# EAGLE design adf5355_eval (EAGLE 6.5.0)
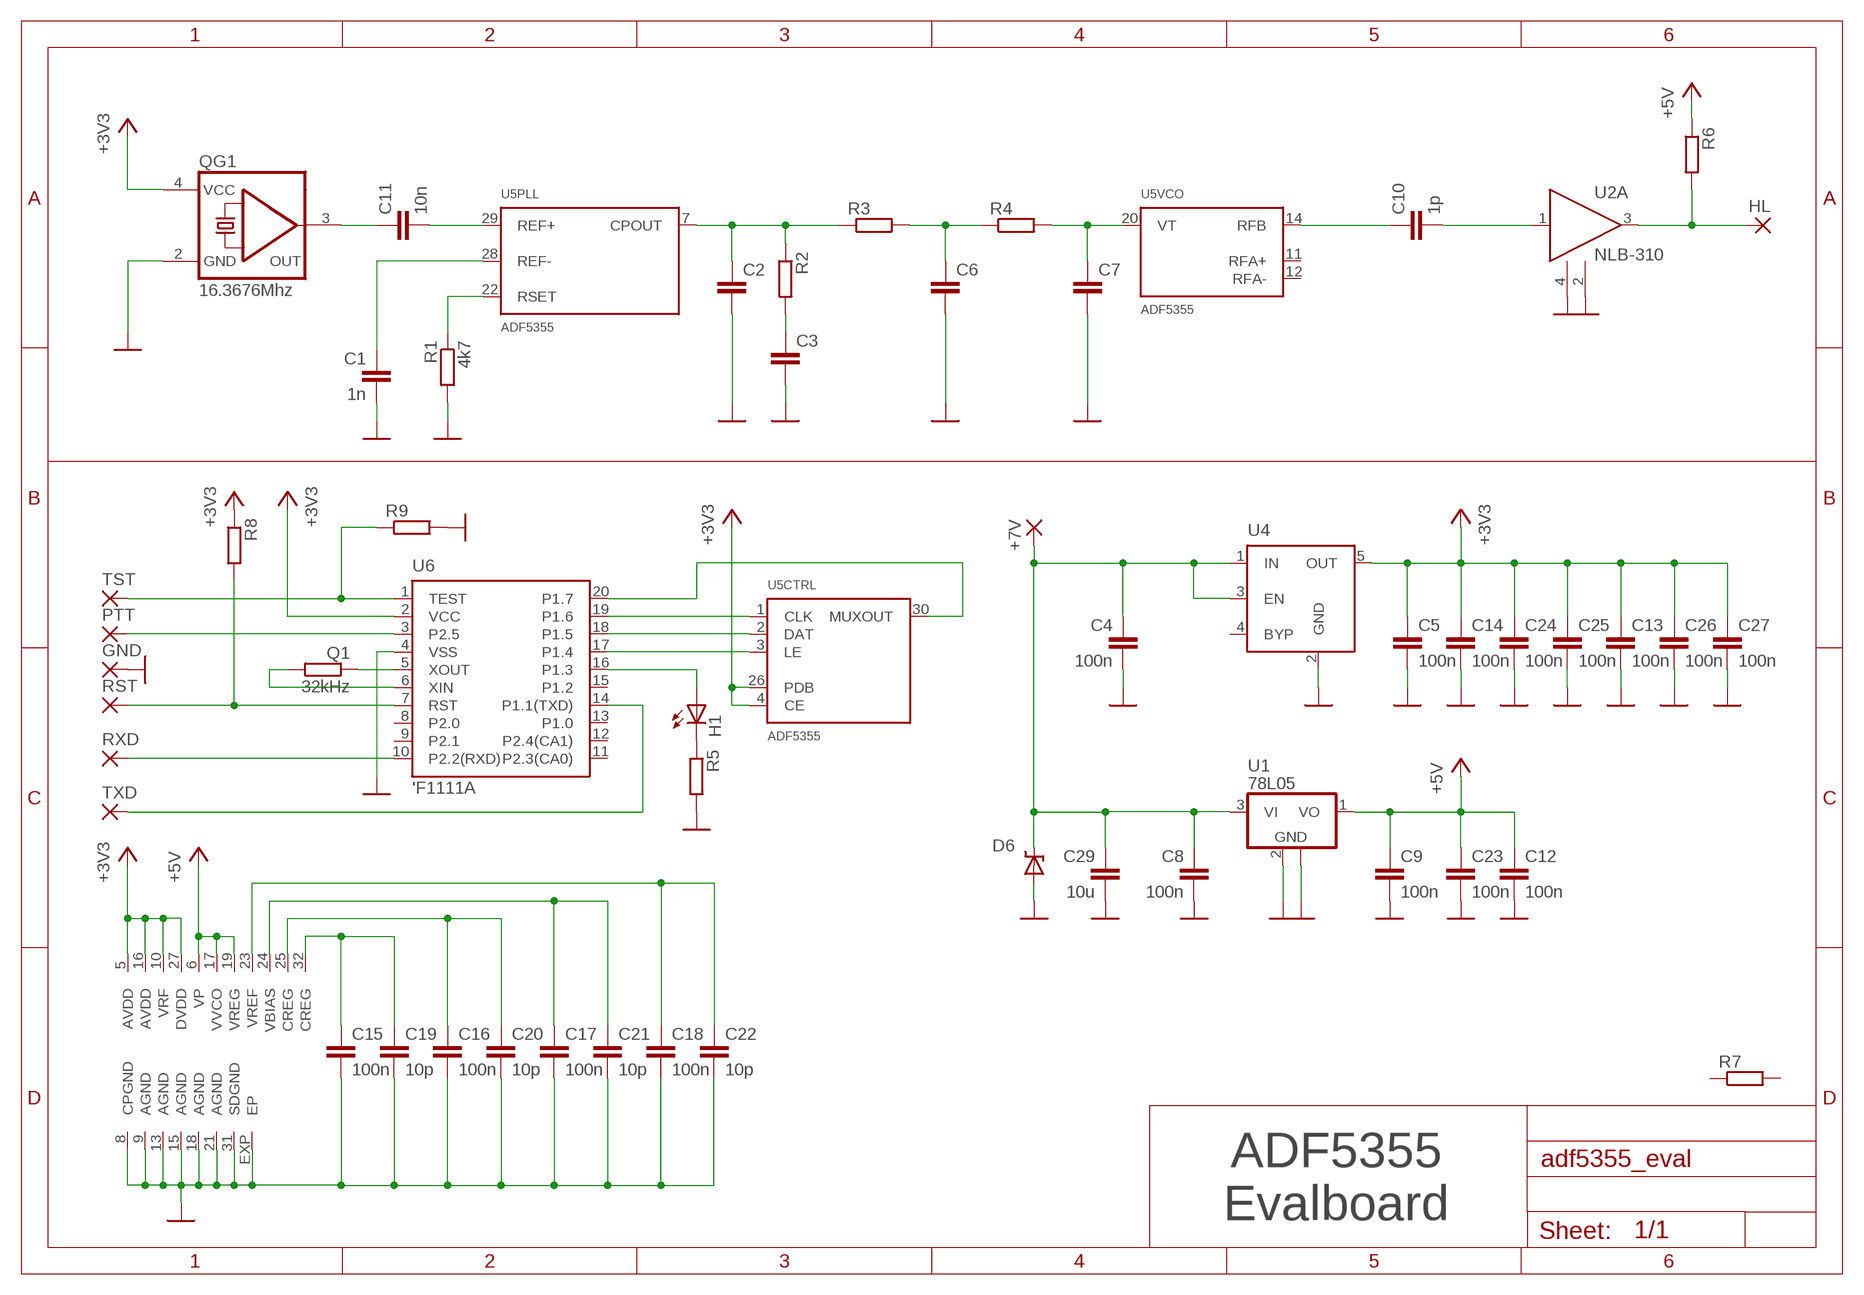
[diagram p0: schematic, sheet 1]

## Parts
+7V  SMD2  [SMD1,27-2,54]
C1  1n  C-EUC0402  [C0402]
C2  C-EUC0402  [C0402]
C3  C-EUC0402  [C0402]
C4  100n  C-EUC0805  [C0805]
C5  100n  C-EUC0402  [C0402]
C6  C-EUC0402  [C0402]
C7  C-EUC0402  [C0402]
C8  100n  C-EUC0805  [C0805]
C9  100n  C-EUC0805  [C0805]
C10  1p  C-EUC0603  [C0603]
C11  10n  C-EUC0402  [C0402]
C12  100n  C-EUC0402  [C0402]
C13  100n  C-EUC0402  [C0402]
C14  100n  C-EUC0805  [C0805]
C15  100n  C-EUC0402  [C0402]
C16  100n  C-EUC0402  [C0402]
C17  100n  C-EUC0402  [C0402]
C18  100n  C-EUC0402  [C0402]
C19  10p  C-EUC0402  [C0402]
C20  10p  C-EUC0402  [C0402]
C21  10p  C-EUC0402  [C0402]
C22  10p  C-EUC0402  [C0402]
C23  100n  C-EUC0603  [C0603]
C24  100n  C-EUC0805  [C0805]
C25  100n  C-EUC0402  [C0402]
C26  100n  C-EUC0402  [C0402]
C27  100n  C-EUC0402  [C0402]
C29  10u  C-EUC0805  [C0805]
D6  SUPPRESSOR-SMBJ  [SMBJ]
GND  SMD2  [SMD1,27-2,54]
H1  PL006-WCR12  [SOT23]
HL  1,6/0,9  [1,6/0,9]
PTT  SMD2  [SMD1,27-2,54]
Q1  32kHz  R-EU_R1206  [R1206]
QG1  16.3676Mhz  XO  [CTS406]
R1  4k7  R-EU_R0402  [R0402]
R2  R-EU_R0402  [R0402]
R3  R-EU_R0402  [R0402]
R4  R-EU_R0402  [R0402]
R5  R-EU_R0603  [R0603]
R6  R-EU_R0603  [R0603]
R7  R-EU_R0402  [R0402]
R8  R-EU_R0402  [R0402]
R9  R-EU_R0402  [R0402]
RST  SMD2  [SMD1,27-2,54]
RXD  SMD2  [SMD1,27-2,54]
TST  SMD2  [SMD1,27-2,54]
TXD  SMD2  [SMD1,27-2,54]
U1  78L05  78L05F  [SOT89]
U2  NLB-310  ERA  [WW107]
U4  MIC5219XX  [SOT23-5]
U5  ADF5355  [LFCSP32]
U6  'F1111A  F11X1A---PW20  [PW20]

## Nets
+3V3: C5.1 C13.1 C14.1 C24.1 C25.1 C26.1 C27.1 QG1.4(VCC) R8.1 U4.5(OUT) U5.4(CTRL:CE) U5.5(PWR:AVDD) U5.10(PWR:VRF) U5.16(PWR:AVDD) U5.26(CTRL:PDB) U5.27(PWR:DVDD) U6.2(VCC)
+5V: C9.1 C12.1 C23.1 R6.1 U1.1(VO) U5.6(PWR:VP) U5.17(PWR:VVCO) U5.19(PWR:VREG)
GND: C1.2 C2.2 C3.2 C4.2 C5.2 C6.2 C7.2 C8.2 C9.2 C12.2 C13.2 C14.2 C15.2 C16.2 C17.2 C18.2 C19.2 C20.2 C21.2 C22.2 C23.2 C24.2 C25.2 C26.2 C27.2 C29.2 D6.A GND.1(P) QG1.2(GND) R1.2 R5.2 R9.2 U1.2(GND) U1.2@1(GND) U2.2(P:GND) U2.4(P:GND) U4.2(GND) U5.8(PWR:CPGND) U5.9(PWR:AGND) U5.13(PWR:AGND) U5.15(PWR:AGND) U5.18(PWR:AGND) U5.21(PWR:AGND) U5.31(PWR:SDGND) U5.EXP(PWR:EP) U6.4(VSS)
N$1: C6.1 R3.2 R4.1
N$2: C2.1 R2.1 R3.1 U5.7(PLL:CPOUT)
N$3: R1.1 U5.22(PLL:RSET)
N$4: C1.1 U5.28(PLL:REF-)
N$5: C7.1 R4.2 U5.20(VCO:VT)
N$6: +7V.1(P) C4.1 C8.1 C29.1 D6.C U1.3(VI) U4.1(IN) U4.3(EN)
N$7: C11.2 U5.29(PLL:REF+)
N$8: C11.1 QG1.3(OUT)
N$9: C10.1 U5.14(VCO:RFB)
N$10: C10.2 U2.1(A:IN)
N$11: R9.1 TST.1(P) U6.1(TEST)
N$12: C3.1 R2.2
N$13: HL.1(P) R6.2 U2.3(A:OUT)
N$14: R8.2 RST.1(P) U6.7(RST)
N$15: PTT.1(P) U6.3(P2.5)
N$17: H1.1(A) U6.16(P1.3)
N$18: H1.3(C) R5.1
N$20: C18.1 C22.1 U5.23(PWR:VREF)
N$22: C17.1 C21.1 U5.24(PWR:VBIAS)
N$23: Q1.2 U6.6(XIN)
N$24: C16.1 C20.1 U5.25(PWR:CREG)
N$25: Q1.1 U6.5(XOUT)
N$26: C15.1 C19.1 U5.32(PWR:CREG)
N$27: RXD.1(P) U6.10(P2.2(RXD))
N$33: TXD.1(P) U6.14(P1.1(TXD))
N$34: U5.1(CTRL:CLK) U6.19(P1.6)
N$35: U5.2(CTRL:DAT) U6.18(P1.5)
N$36: U5.3(CTRL:LE) U6.17(P1.4)
N$37: U5.30(CTRL:MUXOUT) U6.20(P1.7)
Unconnected: R7.1 R7.2 U4.4(BYP) U5.11(VCO:RFA+) U5.12(VCO:RFA-) U6.8(P2.0) U6.9(P2.1) U6.11(P2.3(CA0)) U6.12(P2.4(CA1)) U6.13(P1.0) U6.15(P1.2)

## Notes on the sheet
- ADF5355
  Evalboard

## Library data of the parts
+7V GND PTT RST RXD TST TXD = wirepad:SMD2: SMD PAD
C1-C27 C29 = rcl:C-EU: CAPACITOR, European symbol
D6 = diode:SUPPRESSOR-: Suppressor diode
H1 = led:PL006*: PLH006 Series SMD LED SOT23 PLH006-WCR21 Super Red PLH006-WCR12 High Eff Red PLH006-WCG13 Green PLH006-WCY01 Yellow www.p-tec.net Source: http://www.wittig-electronic.de/PTEC/PL006Series.pdf
HL = wirepad:1,6/0,9: THROUGH-HOLE PAD
Q1 R1-R9 = rcl:R-EU_: RESISTOR, European symbol
QG1 = RS92TCXO:XO: CRYSTAL
U1 = linear:78L*: POSITOIV-VOLTAGE REGULATORS Output up to 100 mA Source: http://focus.ti.com/lit/ds/symlink/ua78l05.pdf
U2 = ERA:ERA
U4 = v-reg-micrel:MIC5219XX: VOLTAGE REGULATOR; OC_FARNELL: unknown; OC_NEWARK: unknown
U5 = ADF5355:ADF5355
U6 = TI_MSP430_v16:F11X1A---PW20: *** MSP430F11x1A *** PW20

## Board
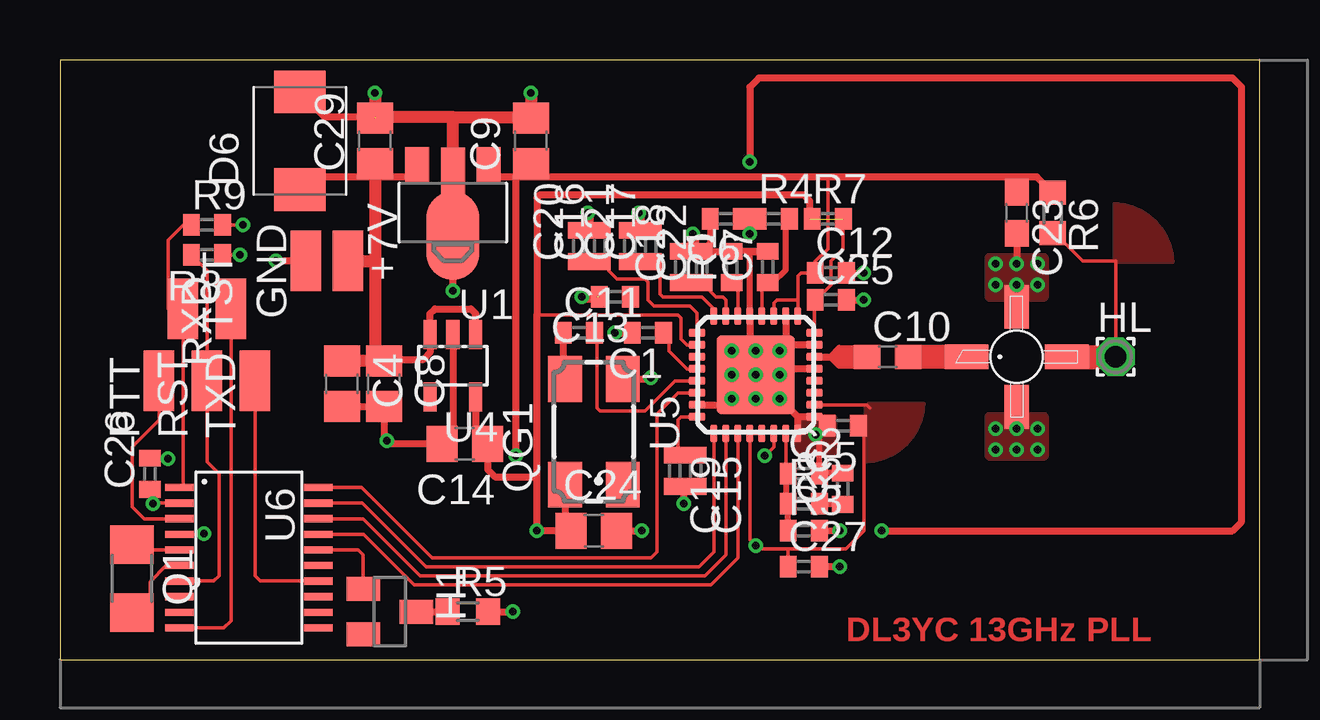
[diagram p1: board, top side]
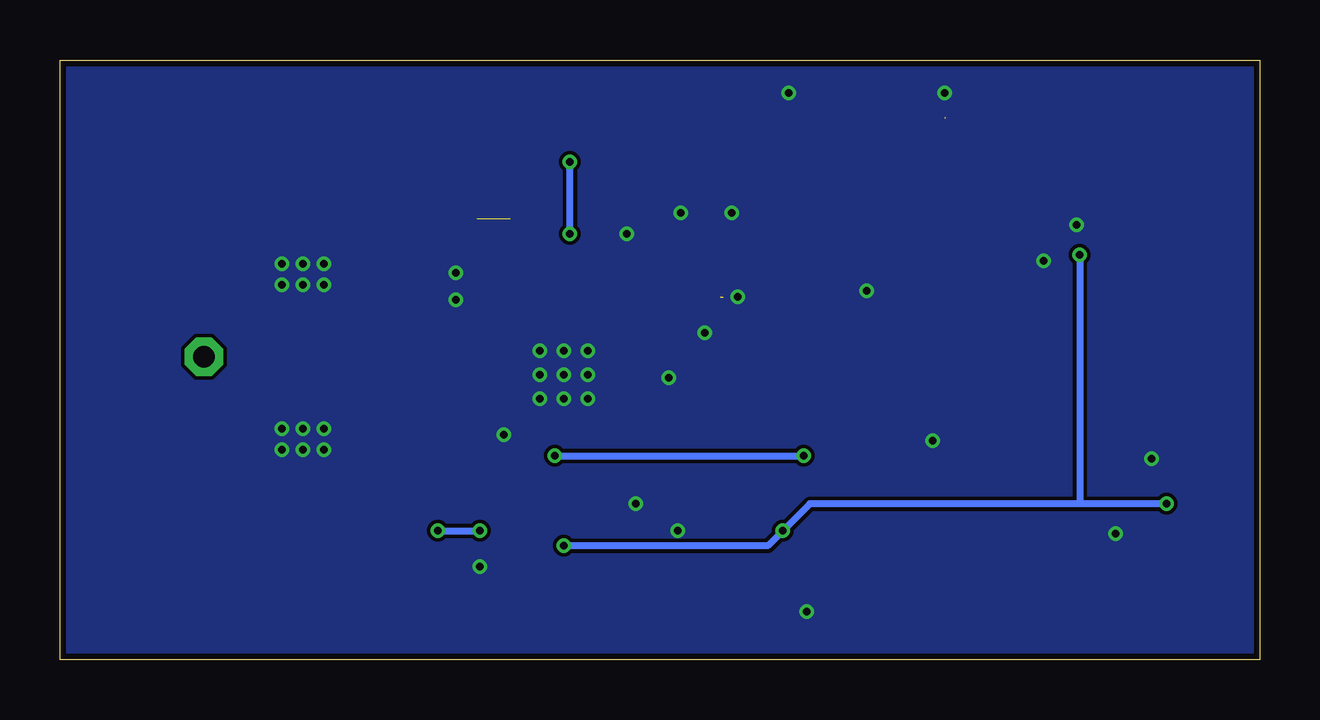
[diagram p2: board, bottom side, seen from below]

Size 50 x 25 mm. Coordinates in mm from the lower left corner, seen from the top.
Outline: 0,0 50,0 50,25 0,25 0,0
Copper layers (1*16): Top 0.035mm / dielectric 1.5mm / Bottom 0.035mm
Design rules "SeeedStudio_2layer_DRU_no_angle_20140221 *": minimum track width 6mil, minimum drill 12mil, track to track 6mil, track to pad 6mil, pad to pad 6mil, via to via 6mil, smd to smd 0mil, copper to edge 10mil, drill to drill 10mil, minimum pad ring 10mil, minimum via ring 6mil, stop-mask expansion 2mil, vias tented up to drill 100mil, thermal gap 10mil

### Footprints (pad centres in the part's own frame; a part is rotated, then mirrored left to right if it is on the bottom)
SMD1,27-2,54 = smd 1.27 x 2.54: 1 0,0
C0402 = smd 0.7 x 0.9: 1 -0.65,0; 2 0.65,0
C0805 = smd 1.3 x 1.5: 1 -0.95,0; 2 0.95,0
C0603 = smd 1.1 x 1: 1 -0.85,0; 2 0.85,0
SMBJ = smd 1.78 x 2.16: A 2.04,0; C -2.03,0
SOT23 = smd 1 x 1.4: 1 -0.95,-1.1; 2 0.95,-1.1; 3 0,1.1
1,6/0,9 = drill 0.914 pad 1.6 octagon: 1 0,0
R1206 = smd 1.6 x 1.803: 1 -1.422,0; 2 1.422,0
CTS406 = smd 1.9 x 1.4: 1 -2.2,-1.2; 2 2.2,-1.2; 3 2.2,1.2; 4 -2.2,1.2
R0402 = smd 0.7 x 0.9: 1 -0.65,0; 2 0.65,0
R0603 = smd 1 x 1.1: 1 -0.85,0; 2 0.85,0
SOT89 = smd 1 x 1.5: 1 -1.499,-1.981; 3 1.499,-1.981 | smd 1 x 2: 2 0,-1.727 | smd 2.2 x 3.7: 2@1 0,0.94
WW107 = smd 1.02 x 1.83: 1 0,-2.085; 3 0,2.085 | smd 1.83 x 1.02: 2 2.085,0; 4 -2.085,0
SOT23-5 = smd 0.55 x 1.2: 1 -0.95,-1.3; 2 0,-1.3; 3 0.95,-1.3; 4 0.95,1.3; 5 -0.95,1.3
LFCSP32 = smd 0.7 x 0.3: 1 -2.45,1.75; 2 -2.45,1.25; 3 -2.45,0.75; 4 -2.45,0.25; 5 -2.45,-0.25; 6 -2.45,-0.75; 7 -2.45,-1.25; 8 -2.45,-1.75; 17 2.45,-1.75; 18 2.45,-1.25; 19 2.45,-0.75; 20 2.45,-0.25; 21 2.45,0.25; 22 2.45,0.75; 23 2.45,1.25; 24 2.45,1.75 | smd 0.3 x 0.7: 9 -1.75,-2.45; 10 -1.25,-2.45; 11 -0.75,-2.45; 12 -0.25,-2.45; 13 0.25,-2.45; 14 0.75,-2.45; 15 1.25,-2.45; 16 1.75,-2.45; 25 1.75,2.45; 26 1.25,2.45; 27 0.75,2.45; 28 0.25,2.45; 29 -0.25,2.45; 30 -0.75,2.45; 31 -1.25,2.45; 32 -1.75,2.45 | smd 3.25 x 3.25: EXP 0,0
PW20 = smd 0.3 x 1.2: 1 -2.925,-2.9; 2 -2.275,-2.9; 3 -1.625,-2.9; 4 -0.975,-2.9; 5 -0.325,-2.9; 6 0.325,-2.9; 7 0.975,-2.9; 8 1.625,-2.9; 9 2.275,-2.9; 10 2.925,-2.9; 11 2.925,2.9; 12 2.275,2.9; 13 1.625,2.9; 14 0.975,2.9; 15 0.325,2.9; 16 -0.325,2.9; 17 -0.975,2.9; 18 -1.625,2.9; 19 -2.275,2.9; 20 -2.925,2.9

### Placement (x,y rotation side)
+7V  12,16.62 180 top
C1  24.5,13.62 180 top
C2  31,7.75 0 top
C3  32.62,7.12 90 top
C4  11.75,11.5 270 top
C5  32.62,9.75 180 top
C6  27.75,18.38 180 top
C7  29.5,16.38 90 top
C8  13.5,11.5 270 top
C9  19.62,21.62 90 top
C10  34.5,12.62 0 top
C11  21.62,13.62 0 top
C12  32.12,16.12 0 top
C13  23.12,15.12 180 top
C14  16.88,9 180 top
C15  26.5,7.88 270 top
C16  22.5,17.25 90 top
C17  24.62,17.25 90 top
C18  25.88,16.38 90 top
C19  25.62,7.88 270 top
C20  21.62,17.25 90 top
C21  23.75,17.25 90 top
C22  26.75,16.38 90 top
C23  39.88,18.62 270 top
C24  22.25,5.38 0 top
C25  32.12,15 0 top
C26  3.75,7.75 90 top
C27  31,3.88 0 top
C29  13.12,21.62 90 top
D6  10,21.62 90 top
GND  10.25,16.62 0 top
H1  13.75,2 270 top
HL  44,12.62 0 top
PTT  4.12,11.62 0 top
Q1  3,3.38 270 top
QG1  22.25,9.5 90 top
R1  28,16.38 90 top
R2  31,6.5 0 top
R3  31,5.38 0 top
R4  29.75,18.38 0 top
R5  17,2 0 top
R6  41.38,18.62 270 top
R7  32,18.38 0 top
R8  6.12,16.88 180 top
R9  6.12,18.12 0 top
RST  6.12,11.62 0 top
RXD  7.12,14.62 0 top
TST  5.12,14.62 180 top
TXD  8.12,11.62 0 top
U1  16.38,18.62 180 top
U2  39.88,12.62 270 top
U4  16.38,12.25 180 top
U5  29,11.88 90 top
U6  7.88,4.25 270 top

### Tracks (layer width: path | path; a pad name or v marks a point on that pad's centre or on a via)
+3V3  (via drill 0.3)  (1 unrouted)
  Top 0.152: U5.10 32.38,10.62
  Top 0.155: U5.27 U5.26 26.12,13.12 25.88,13.38 25.88,14.25 25.75,14.38 23.75,14.38 | 23.75,14.38 19.88,14.38 | U5.5 U5.4 28.75,5 v29,4.75 29.12,4.62 30.38,4.62 | 30.38,4.62 32.75,4.62 33.5,5.38 33.5,9.53 C5.1 | U5.16 31.45,14.6 C25.1 31.48,14.97 32.12,15.62 32.12,16.62 32.62,17.12 32.62,18.38 | U6.2 3.9,6.53 v3.88,6.5 C26.1 | 32.38,10.62 33.62,10.62 33.75,10.5 | C13.1 23.77,14.4 23.75,14.38 | C27.1 30.35,4.6 30.38,4.62 | R8.1 v7.5,16.88
  Top 0.3: 19.88,7.5 v19.88,5.38 C24.1 21.05,5.62 QG1.4 | 19.88,7.5 19.88,14.38 19.88,19.25 20,19.38 31,19.38 31.25,19.12 31.25,18.38 | U4.5 17.32,9.5 C14.1 17.82,7.92 18.12,7.62 19.75,7.62 19.88,7.5
  Bottom 0.3: v29,4.75 20.5,4.75 v19.88,5.38 18.75,6.5 7.5,6.5 | v3.88,6.5 7.5,6.5 | v7.5,16.88 7.5,6.5
  pour Top (no thermals): 33.69,10.68 33.57,10.56 33.58,8.24 33.95,8.28 34.32,8.38 34.67,8.53 34.99,8.73 35.27,8.98 35.52,9.26 35.72,9.58 35.87,9.93 35.97,10.3 36.01,10.67
+5V  (via drill 0.3)
  Top 0.155: U5.6 29.75,8.88 v29.38,8.5 | U5.19 29.75,14.88 29.88,15 30.75,15 | U5.17 30.75,15 | 32,20.12 32,17.12 31.48,16.6 C12.1 30.88,16.12 30.75,16 30.75,15
  Top 0.3: 39.88,20.12 40.73,20.12 R6.1 | 39.88,20.12 32,20.12 19.62,20.12 | 19.62,20.12 19,20.12 | C23.1 39.88,20.12 | v19,8.5 19,20.12 | 19,20.12 18.36,20.12 U1.1 | C9.1 19.62,20.12
  Bottom 0.3: v29.38,8.5 v19,8.5
GND  (via drill 0.3)  (2 unrouted)
  Top 0.155: U6.4 5.9,5.22 v6,5.25 | v4.5,8.38 C26.2 | R9.2 v7.62,18.12
  Top 0.25: v31.5,9.38 31.65,9.22 C2.2 31.68,7.78 C3.2 | U5.21 28.75,17 29.48,17 C7.2 | C7.2 R1.2 C22.2 | C18.2 C22.2 | C6.2 27.1,17.38 C22.2 | C22.2 26.27,17.02 26.25,17 27.88,17 28,17.12 28,17 | C7.2 29.48,17.02 29.38,17.12
  Top 0.3: U5.31 29,10.62 U5.EXP | U5.13 29,12.12 U5.EXP | U5.15 30.25,13.12 | U5.18 30.25,13.12 | 30.25,13.12 U5.EXP | U5.21 28.75,12.12 U5.EXP | U5.8 30.75,10.12 | U5.9 30.75,10.12 | 30.75,10.12 U5.EXP | v23.12,13.62 C1.2 | C15.2 C19.2 25.9,7.22 26,7.12 v26,6.5 | QG1.2 24.57,11.7 v24.62,11.75 | C24.2 v24.25,5.38 | C23.2 v39.88,16.5 | U4.2 16.38,9.3 C14.2 13.75,9 v13.62,9.12 13.5,9.25 C8.2 C4.2 | v16.38,15.38 U1.2@1 U1.2 | R5.2 v18.88,2 | 13.12,22.62 11.04,22.62 D6.A | C25.2 v33.5,15 | C12.2 v33.5,16.12 | GND.1 v9,16.62 | v32.5,3.88 C27.2
  Top 0.5: C20.2 C16.2 22.1,17.9 22,18 v22,18.62 | C17.2 C21.2 23.9,17.9 24.12,18.12 v24.12,18.62 | v26.38,17.75 26.38,17.12 | U1.2 16.38,22.62 | 16.38,22.62 13.12,22.62 | 13.12,22.62 12.62,22.62 | 16.38,22.62 19.57,22.62 C9.2 | v13.12,23.62 13.12,22.62 | v19.62,23.62 19.62,22.62 | 22.38,15.12 v21.75,15.12
  other vias: 39,15.62 39,16.5 39.88,15.62 40.75,15.62 40.75,16.5 39.88,9.62 39,9.62 40.75,9.62 40.75,8.75 39.88,8.75 39,8.75 29,11.88 28,12.88 30,12.88 30,10.88 28,10.88 29,12.88 28,11.88 30,11.88 29,10.88
  pour Top (no thermals): 38.75,16.75 41,16.75 41,15.12 38.75,15.12
  pour Top (no thermals): 38.75,10.12 41,10.12 41,8.5 38.75,8.5
  pour Top (no thermals): 30.75,10.12 32.25,10.12 32.25,8.62 30.75,8.62
  pour Bottom (no thermals): 0,25 50,25 50,0 0,0
N$1  (via drill 0.3)
  Top 0.25: 28.75,18.38 R4.1 | C6.1 28.75,18.38 | 28.75,18.38 v28.75,17.75
  Top 0.3: v32.5,5.38 31.88,5.35 R3.2 | v34.25,5.38 48.88,5.38 49.25,5.75 49.25,23.88 48.88,24.25 29.12,24.25 28.75,23.88 v28.75,20.75
  Bottom 0.3: v28.75,17.75 v28.75,20.75 | v34.25,5.38 v32.5,5.38
N$2
  Top 0.152: U5.7 30.25,7.75
  Top 0.25: C2.1 30.25,7.75 30.25,6.6 R2.1 R3.1
N$3
  Top 0.152: U5.22 28.25,15.47
  Top 0.25: 28.25,15.47 R1.1
N$4
  Top 0.155: U5.28 26.12,12.12 25.38,12.88 25.38,13.4 C1.1
N$5
  Top 0.152: U5.20 29.25,15.47
  Top 0.25: 29.25,15.47 C7.1 29.73,15.72 30.25,16.25 30.25,18.23 R4.2
N$6
  Top 0.3: C8.1 13.55,12.5 15.12,12.5 15.43,12.8 U4.3 15.43,14.43 15.62,14.62 17.12,14.62 17.32,14.43 U4.1 | U1.3 14.88,20.5 14.5,20.12 13.12,20.12 10.53,20.12 D6.C
  Top 0.5: C29.1 13.12,20.12 13.12,17.12 13.12,16.62 | C4.1 C8.1 13.12,12.82 13.12,16.62 | +7V.1 13.12,16.62
N$7
  Top 0.155: U5.29 25.62,11.62 24.38,10.38 22.5,10.38 22.38,10.5 22.38,13.53 C11.2
N$8
  Top 0.3: C11.1 20.98,11.03 21,11 21,11.65 QG1.3
N$9
  Top 0.3: U5.14 32.12,12.62 | 33.62,12.62 C10.1 33.3,12.28 32.48,12.28 32.12,12.62 | 33.62,12.62 33.5,12.62 | 32.12,12.62 32.48,12.97 33.27,12.97 33.62,12.62
  Top 0.5: 33.62,12.62 32.38,12.62
N$10
  Top 1: U2.1 C10.2
N$11
  Top 0.155: U6.1 5.12,7.33 TST.1 4.5,14.62 4.5,17.5 5.12,18.12 R9.1
N$12
  Top 0.25: R2.2 32.48,6.5 C3.1
N$13
  Top 0.155: R6.2 41.48,17.77 42.62,16.62 44,16.62 HL.1
  Top 1: U2.3 HL.1
  pour Top (no thermals): 43.95,16.69 44.07,16.57 46.38,16.58 46.34,16.95 46.24,17.32 46.09,17.67 45.89,17.99 45.65,18.27 45.36,18.52 45.04,18.72 44.69,18.87 44.33,18.97 43.95,19.01
N$14
  Top 0.155: U6.7 6.4,3.27 6.62,3.5 6.62,7.75 6.12,8.25 RST.1 6.12,16.23 R8.2
N$15
  Top 0.155: U6.3 3.5,5.88 3,6.38 3,8.88 4.12,10 PTT.1
N$17
  Top 0.155: U6.16 12.43,4.58 12.62,4.38 12.62,2.98 H1.1
N$18
  Top 0.3: H1.3 R5.1
N$20
  Top 0.155: U5.23 27.75,15 27.62,15.12 27.35,15.12 C22.1
  Top 0.25: C18.1 C22.1
N$22
  Top 0.155: U5.24 27.25,14.62 26.75,15.12 25.12,15.12 25,15.25 25,16.23 C17.1
  Top 0.25: C21.1 C17.1
N$23
  Top 0.155: U6.6 4.42,3.92 3.75,3.25 3.75,2.5 3.55,2.5 Q1.2
N$24
  Top 0.155: U5.25 26.55,14.45 26.25,14.75 24.75,14.75 24.5,15 24.5,15.75 24.38,15.88 23.23,15.88 C16.1
  Top 0.25: C16.1 C20.1
N$25
  Top 0.155: U6.5 3.1,4.58 Q1.1
N$26
  Top 0.155: U5.32 25.88,10.12 25.75,10 25.75,8.65 C19.1
  Top 0.25: C15.1 C19.1
N$27
  Top 0.155: U6.10 6.83,1.32 7.12,1.62 RXD.1
N$33
  Top 0.155: U6.14 8.35,3.27 8.12,3.5 TXD.1
N$34
  Top 0.155: U5.1 27.25,4.5 26.62,3.88 15.25,3.88 12.6,6.53 U6.19
N$35
  Top 0.155: U5.2 27.75,4.38 26.88,3.5 15,3.5 12.62,5.88 U6.18
N$36
  Top 0.155: U5.3 28.25,4.25 27.12,3.12 14.75,3.12 12.65,5.22 U6.17
N$37
  Top 0.155: U5.30 25.75,11.12 24.88,10.25 24.88,4.5 24.62,4.25 15.5,4.25 12.57,7.17 U6.20

### Text on the board
Top: DL3YC 13GHz PLL
tStop: DL3YC 13GHz PLL